# EAGLE design UI_breakout (EAGLE 6.5.0)
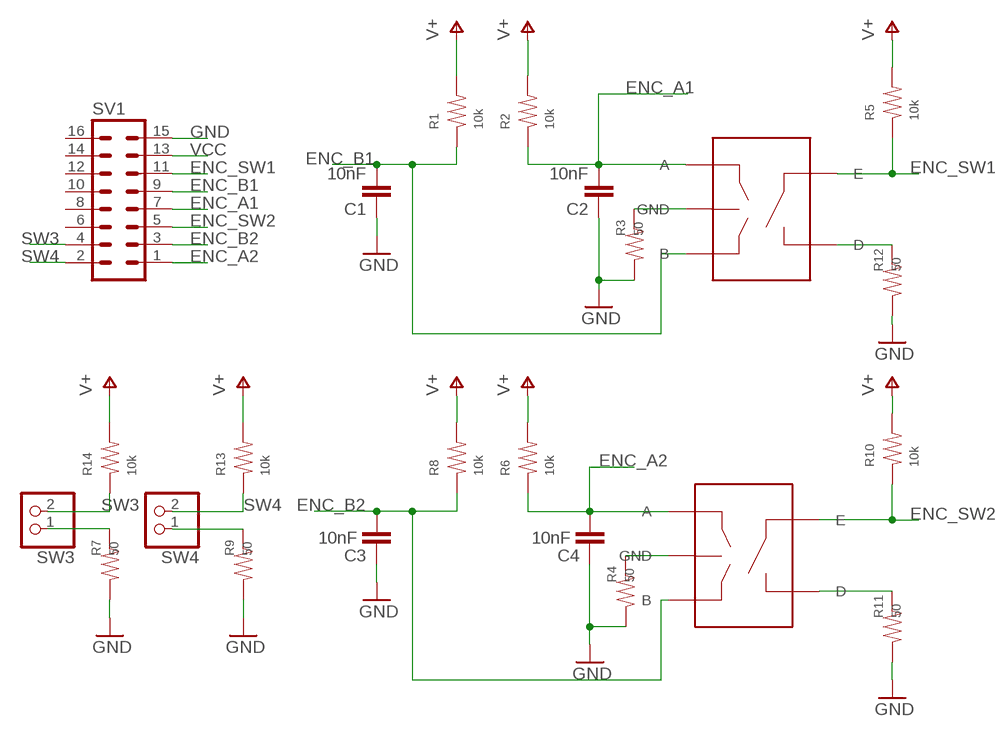
[diagram p0: schematic, sheet 1]

## Parts
C1  10nF  C-EUC0603  [C0603]
C2  10nF  C-EUC0603  [C0603]
C3  10nF  C-EUC0603  [C0603]
C4  10nF  C-EUC0603  [C0603]
ENC1  PEC09  [PEC092320FS]
ENC2  PEC09  [PEC092320FS]
R1  10k  RES0603  [0603]
R2  10k  RES0603  [0603]
R3  50  RES0603  [0603]
R4  50  RES0603  [0603]
R5  10k  RES0603  [0603]
R6  10k  RES0603  [0603]
R7  50  RES0603  [0603]
R8  10k  RES0603  [0603]
R9  50  RES0603  [0603]
R10  10k  RES0603  [0603]
R11  50  RES0603  [0603]
R12  50  RES0603  [0603]
R13  10k  RES0603  [0603]
R14  10k  RES0603  [0603]
SV1  ML16  [ML16]
SW3  PINHD-1X2  [1X02]
SW4  PINHD-1X2  [1X02]

## Nets
C: ENC2.C(GND) R4.2
ENC_A1: C2.2 ENC1.A R2.1 SV1.7
ENC_A2: C4.2 ENC2.A R6.1 SV1.1
ENC_B1: C1.2 ENC1.B R1.1 SV1.9
ENC_B2: C3.2 ENC2.B R8.1 SV1.3
ENC_SW1: ENC1.E R5.1 SV1.11
ENC_SW2: ENC2.E R10.1 SV1.5
GND: C1.1 C2.1 C3.1 C4.1 R3.1 R4.1 R7.1 R9.1 R11.1 R12.1 SV1.15
N$1: R7.2 SW3.1
N$2: R9.2 SW4.1
N$3: ENC1.C(GND) R3.2
N$4: ENC2.D R11.2
N$5: ENC1.D R12.2
SW3: R14.1 SV1.4 SW3.2
SW4: R13.1 SV1.2 SW4.2
VCC: R1.2 R2.2 R5.2 R6.2 R8.2 R10.2 R13.2 R14.2 SV1.13 ; supply symbol labelled V+
Unconnected: SV1.6 SV1.8 SV1.10 SV1.12 SV1.14 SV1.16

## Notes on the sheet
- ENC_A1
- ENC_B1
- ENC_SW1
- ENC_A2
- ENC_B2
- ENC_SW2

## Library data of the parts
C1-C4 = rcl:C-EU: CAPACITOR, European symbol
ENC1 ENC2 = connector-jqi:PEC09: PEC09-2320F-S0015 Rotary Encoder (Bourns).
R1-R14 = rlc-jqi:RES: SMT Resistor
SV1 = aom_driver:ML16: HARTING 2x8 (16 pin) ribbon connector.; OC_FARNELL: unknown; OC_NEWARK: unknown
SW3 SW4 = pinhead:PINHD-1X2: PIN HEADER

## Board
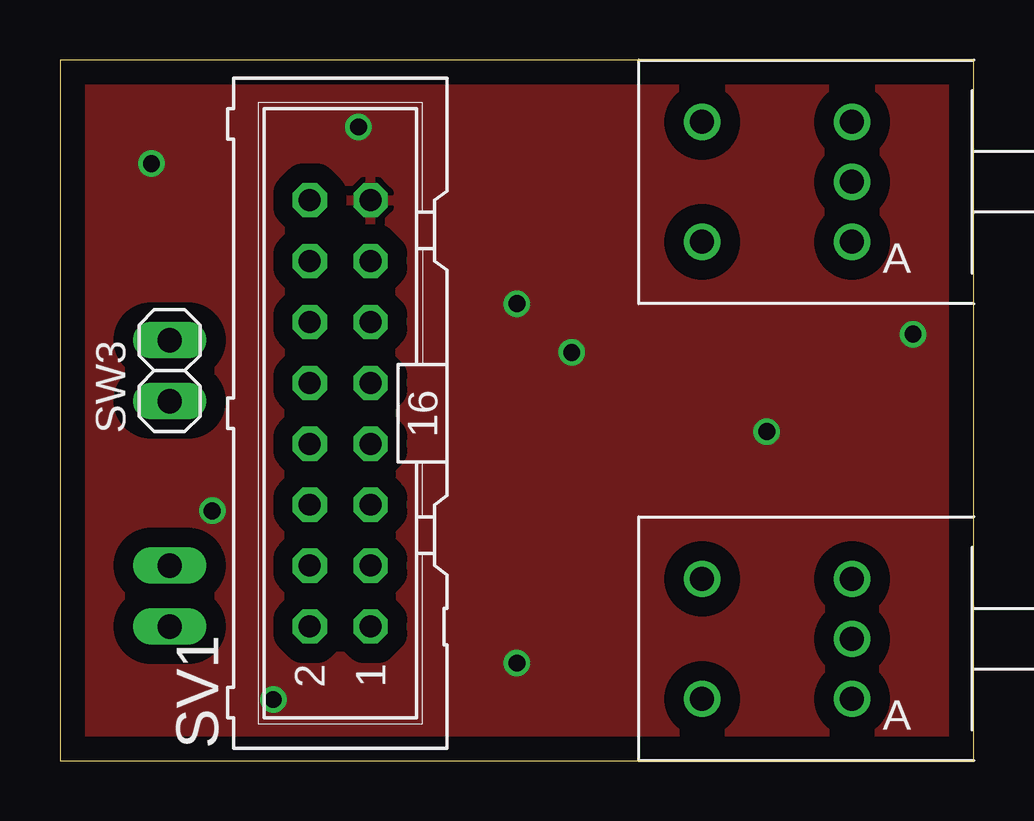
[diagram p1: board, top side]
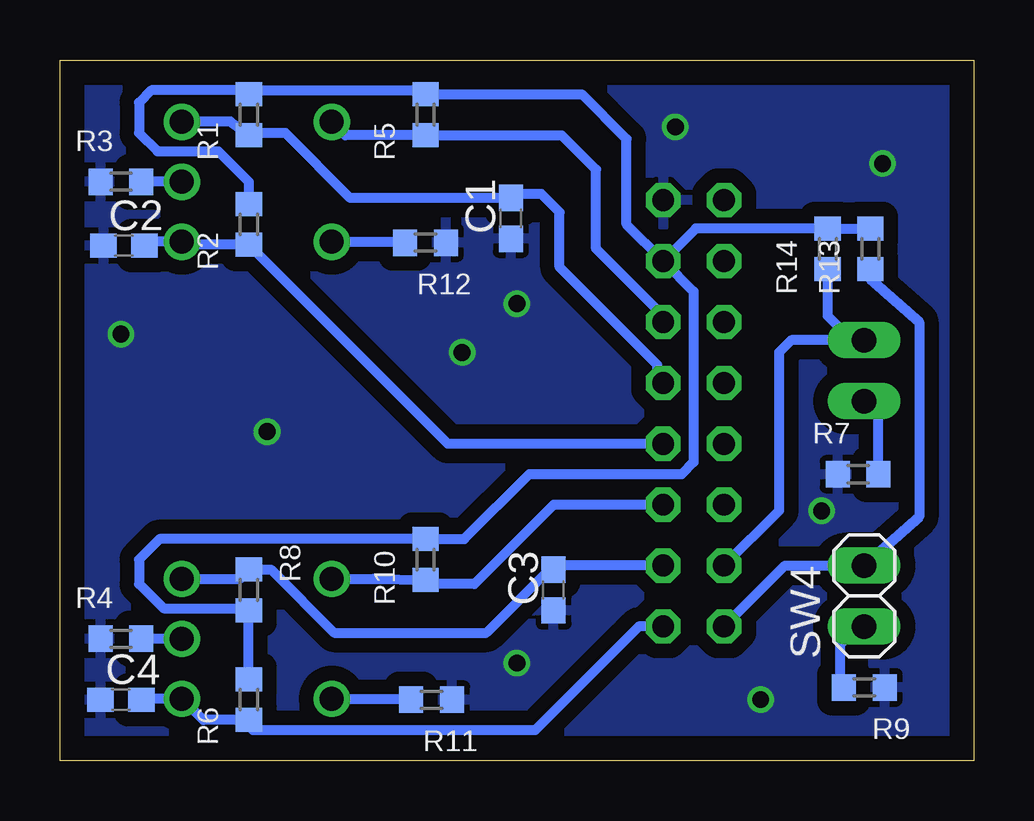
[diagram p2: board, bottom side, seen from below]

Size 38.1 x 29.21 mm. Coordinates in mm from the lower left corner, seen from the top.
Outline: 0,0 38.1,0 38.1,29.21 0,29.21 0,0
Copper layers (1*16): Top 0.035mm / dielectric 1.5mm / Bottom 0.035mm
Design rules "default": minimum track width 10mil, minimum drill 24mil, track to track 8mil, track to pad 8mil, pad to pad 8mil, via to via 8mil, smd to smd 8mil, copper to edge 40mil, drill to drill 8mil, minimum pad ring 10mil, minimum via ring 8mil, stop-mask expansion 4mil, vias tented up to drill 0mil, thermal gap 10mil

### Footprints (pad centres in the part's own frame; a part is rotated, then mirrored left to right if it is on the bottom)
C0603 = smd 1.1 x 1: 1 -0.85,0; 2 0.85,0
PEC092320FS = drill 1: A 0,-2.5; B 0,2.5; C 0,0; D -6.25,-2.5; E -6.25,2.5
0603 = smd 1 x 1.1: 1 -0.85,0; 2 0.85,0
ML16 = drill 0.914 octagon: 1 -8.89,-1.27; 2 -8.89,1.27; 3 -6.35,-1.27; 4 -6.35,1.27; 5 -3.81,-1.27; 6 -3.81,1.27; 7 -1.27,-1.27; 8 -1.27,1.27; 9 1.27,-1.27; 10 1.27,1.27; 11 3.81,-1.27; 12 3.81,1.27; 13 6.35,-1.27; 14 6.35,1.27; 15 8.89,-1.27; 16 8.89,1.27
1X02 = drill 1.016 long: 1 -1.27,0; 2 1.27,0

### Placement (x,y rotation side)
C1  19.3,22.61 90 bottom
C2  35.43,21.46 0 bottom
C3  17.53,7.11 90 bottom
C4  35.56,2.54 0 bottom
ENC1  33.02,24.13 0 top
ENC2  33.02,5.08 0 top
R1  30.23,26.92 90 bottom
R2  30.23,22.35 90 bottom
R3  35.56,24.13 0 bottom
R4  35.56,5.08 0 bottom
R5  22.86,26.92 90 bottom
R6  30.23,2.54 90 bottom
R7  4.83,11.94 0 bottom
R8  30.23,7.11 270 bottom
R9  4.57,3.05 180 bottom
R10  22.86,8.38 90 bottom
R11  22.61,2.54 180 bottom
R12  22.86,21.59 180 bottom
R13  4.32,21.34 90 bottom
R14  6.1,21.34 90 bottom
SV1  11.68,14.48 90 top
SW3  4.57,16.26 90 top
SW4  4.57,6.86 90 bottom

### Tracks (layer width: path | path; a pad name or v marks a point on that pad's centre or on a via)
C
  Bottom 0.406: ENC2.C R4.2
ENC_A1
  Bottom 0.406: C2.2 34.67,21.63 ENC1.A 32.89,21.5 R2.1 21.93,13.21 SV1.7
ENC_A2
  Bottom 0.406: C4.2 34.92,2.58 ENC2.A 32.13,1.69 R6.1 30.06,1.27 18.29,1.27 13.97,5.59 SV1.1
ENC_B1
  Bottom 0.406: ENC1.B 31,26.64 R1.1 30.06,26.16 28.7,26.16 26,23.46 C1.2 18.96,23.62 18.03,23.62 17.27,22.86 17.27,20.57 13.21,16.51 13.21,16 SV1.9
ENC_B2
  Bottom 0.406: ENC2.B 30.61,7.58 R8.1 29.3,7.96 26.67,5.33 20.32,5.33 17.69,7.96 C3.2 17.36,8.13 SV1.3
ENC_SW1
  Bottom 0.406: ENC1.E 26.21,26.07 R5.1 17.18,26.07 15.75,24.64 15.75,21.34 12.95,18.54 SV1.11
ENC_SW2
  Bottom 0.406: ENC2.E 25.02,7.58 R10.1 22.69,7.37 20.83,7.37 17.53,10.67 SV1.5
GND  (via drill 0.7)
  other vias: 19.05,4.06 19.05,19.05 8.89,2.54 6.35,10.41 12.45,26.42 29.46,13.72 21.34,17.02 35.56,17.78 3.81,24.89
  pour Bottom (isolate 0.61): -0.76,30.23 -0.76,-1.02 39.12,-1.02 39.12,30.23
  pour Top (isolate 0.813): -2.54,30.73 -2.54,-2.29 40.64,-2.29 40.64,30.73
N$1
  Bottom 0.406: R7.2 3.98,14.39 SW3.1
N$2
  Bottom 0.406: SW4.1 4.83,5.59 5.59,4.83 5.59,3.21 R9.2
N$3
  Bottom 0.406: ENC1.C R3.2
N$4
  Bottom 0.406: ENC2.D 23.5,2.58 R11.2
N$5
  Bottom 0.406: ENC1.D 23.75,21.63 R12.2
SW3
  Bottom 0.406: R14.1 6.1,18.54 5.33,17.78 SW3.2 7.62,17.53 8.13,17.02 8.13,10.41 SV1.4
SW4
  Bottom 0.406: R13.1 4.32,20.07 2.29,18.29 2.29,10.16 SW4.2 7.87,8.13 SV1.2
VCC
  Bottom 0.406: R13.2 R14.2 11.6,22.19 SV1.13 | R6.2 R8.2 30.31,6.35 33.78,6.35 34.8,7.37 34.8,8.38 33.95,9.23 R10.2 21.25,9.23 18.54,11.94 12.19,11.94 11.68,12.45 11.68,19.56 SV1.13 | R2.2 30.23,24.13 31.5,25.4 34.04,25.4 34.8,26.16 34.8,27.43 34.29,27.94 30.73,27.94 30.31,27.77 R1.2 30.06,27.94 23.03,27.94 R5.2 16.34,27.77 14.48,25.91 14.48,22.35 SV1.13